# EAGLE schematic SenseoControl (EAGLE 6.1)
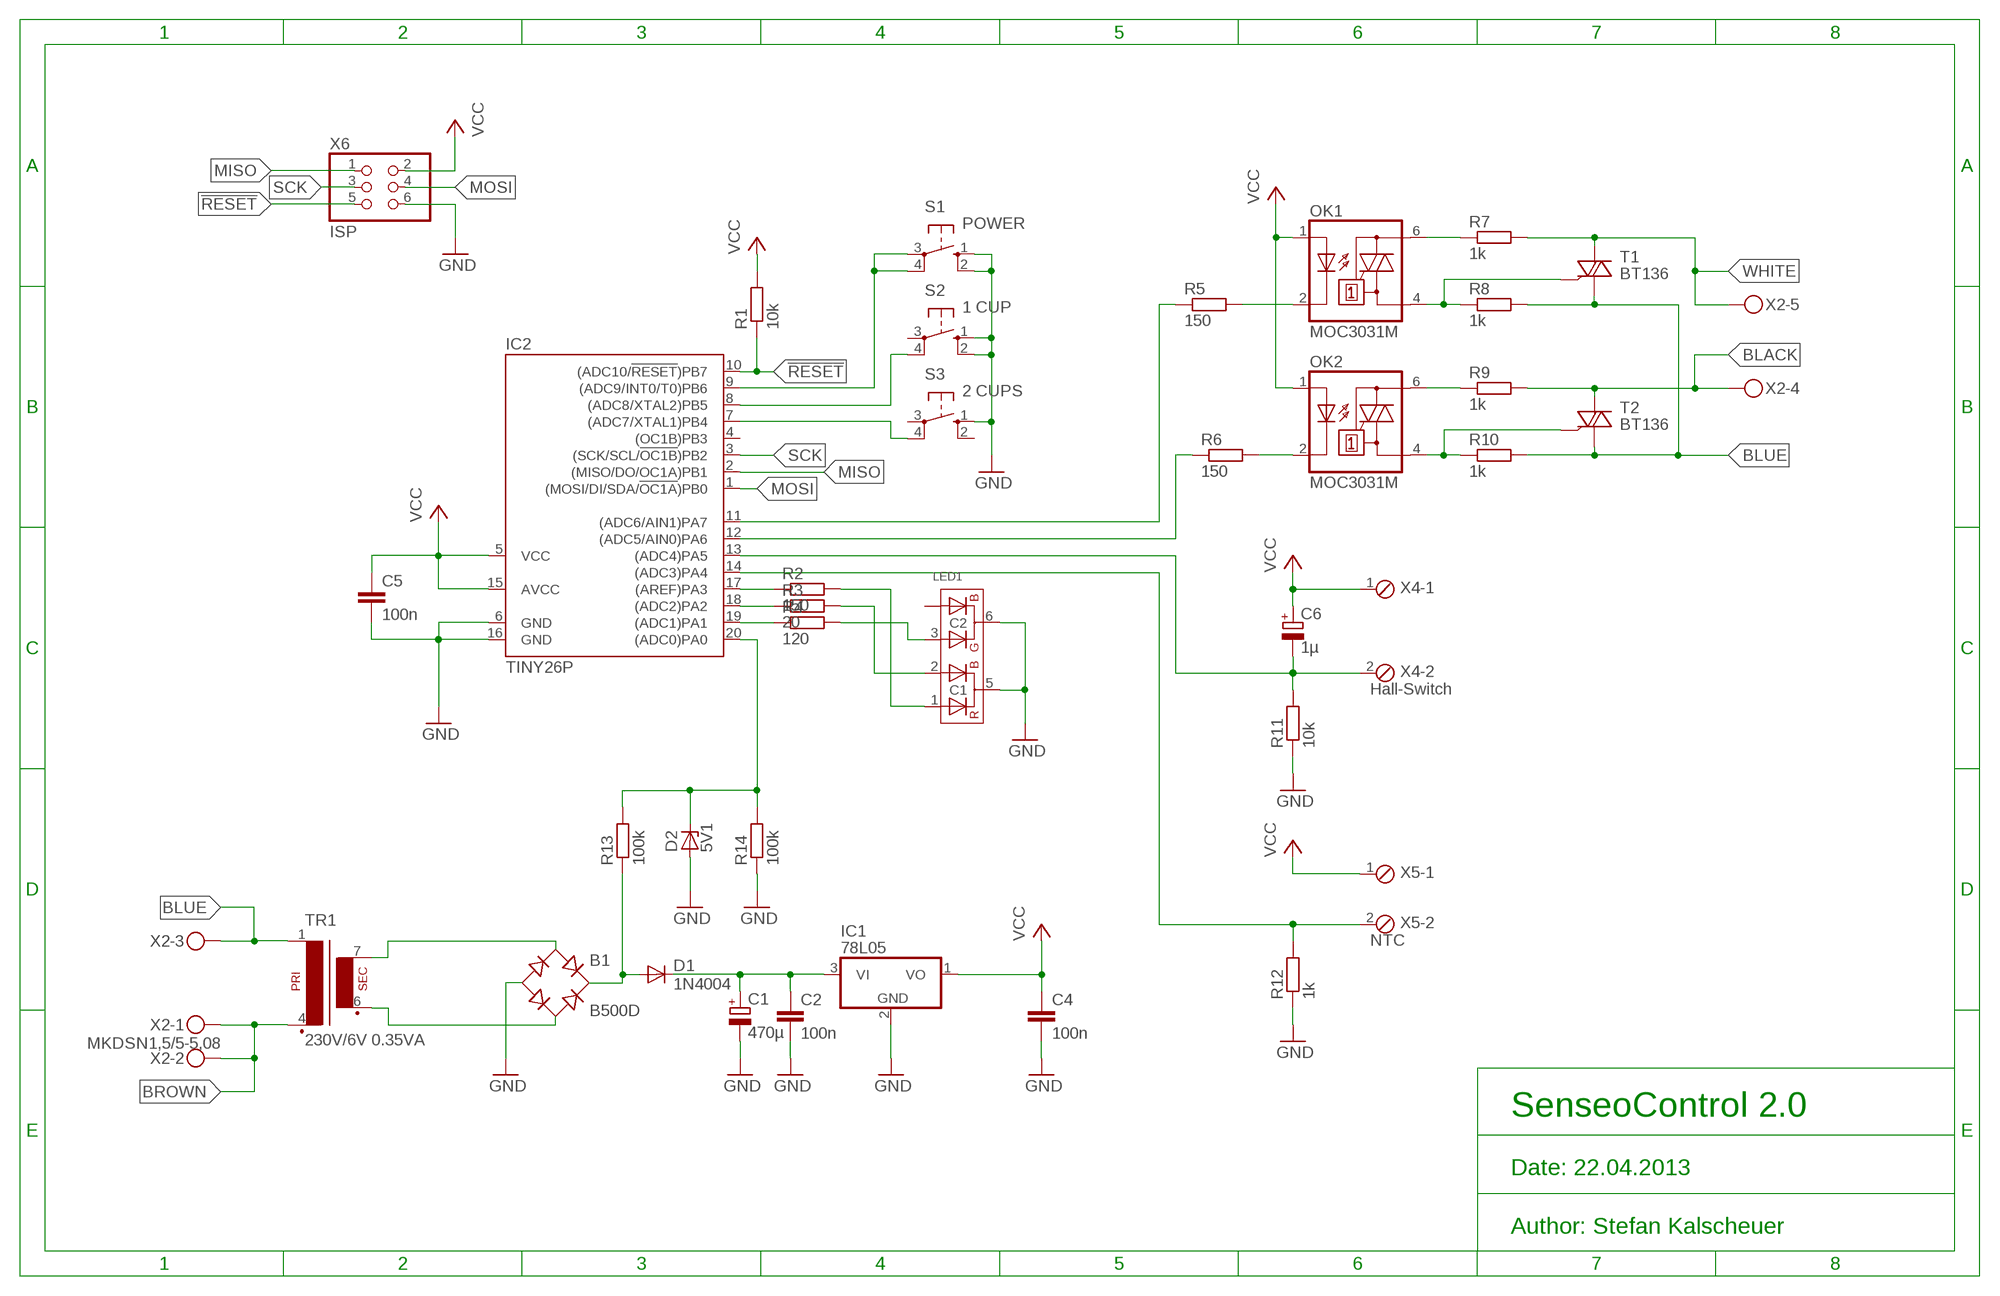
[diagram p0: schematic, sheet 1]

## Parts
B1  B500D  B-DIL  [B-DIL]
C1  470µ  CPOL-EUE2.5-6  [E2,5-6]
C2  100n  C-EU025-024X044  [C025-024X044]
C4  100n  C-EU025-024X044  [C025-024X044]
C5  100n  C-EU025-024X044  [C025-024X044]
C6  1µ  CPOL-EUTT2D5  [TT2D5]
D1  1N4004  DIODE-D-2.5  [D-2.5]
D2  5V1  ZENER-DIODEZD-7.5  [ZDIO-7.5]
IC1  78L05  78L2  [TO92-A]
IC2  TINY26P  [DIL20]
LED1  LF5  [LF5]
OK1  MOC3031M  [DIL06]
OK2  MOC3031M  [DIL06]
R1  10k  R-EU_0207/12  [0207/12]
R2  150  R-EU_0204/7  [0204/7]
R3  20  R-EU_0204/7  [0204/7]
R4  120  R-EU_0204/7  [0204/7]
R5  150  R-EU_0204/7  [0204/7]
R6  150  R-EU_0204/7  [0204/7]
R7  1k  R-EU_0204/7  [0204/7]
R8  1k  R-EU_0204/7  [0204/7]
R9  1k  R-EU_0204/7  [0204/7]
R10  1k  R-EU_0204/7  [0204/7]
R11  10k  R-EU_0204/7  [0204/7]
R12  1k  R-EU_0204/7  [0204/7]
R13  100k  R-EU_0204/7  [0204/7]
R14  100k  R-EU_0204/7  [0204/7]
S1  POWER  10-XXA  [B3F-10XX-A]
S2  1 CUP  10-XXA  [B3F-10XX-A]
S3  2 CUPS  10-XXA  [B3F-10XX-A]
T1  BT136  [TO220AB]
T2  BT136  [TO220AB]
TR1  230V/6V 0.35VA  EE20-1  [EE20-1]
X2  MKDSN1,5/5-5,08  [MKDSN1,5/5-5,08]
X4  Hall-Switch  MPT2  [2POL254]
X5  NTC  MPT2  [2POL254]
X6  ISP  PINHD-2X3  [2X03]

## Nets
!RESET: IC2.10((ADC10/!RESET!)PB7) R1.1 X6.5
BLACK: R9.2 T2.2(A2) X2.4
BLUE: R8.2 R10.2 T1.1(A1) T2.1(A1) TR1.1 X2.3
BROWN: TR1.4(P2) X2.1 X2.2
GND: B1.- C1.- C2.2 C4.2 C5.2 D2.A IC1.2(GND) IC2.6(GND) IC2.16(GND) LED1.5(C1) LED1.6(C2) R11.1 R12.1 R14.1 S1.1(S) S1.2(S1) S2.1(S) S2.2(S1) S3.1(S) X6.6
MISO: IC2.2((MISO/DO/OC1A)PB1) X6.1
MOSI: IC2.1((MOSI/DI/SDA/!OC1A!)PB0) X6.4
N$1: LED1.2(A-BLUE) R3.2
N$2: B1.AC1 TR1.7(S4)
N$3: OK1.4(A1) R8.1 T1.3(G)
N$4: B1.AC2 TR1.6(S3)
N$5: IC2.18((ADC2)PA2) R3.1
N$6: D2.C IC2.20((ADC0)PA0) R13.2 R14.2
N$7: C1.+ C2.1 D1.C IC1.3(VI)
N$8: IC2.7((ADC7/XTAL1)PB4) S3.4(P1)
N$9: IC2.8((ADC8/XTAL2)PB5) S2.4(P1)
N$10: IC2.9((ADC9/INT0/T0)PB6) S1.3(P) S1.4(P1)
N$11: IC2.17((AREF)PA3) R2.1
N$12: LED1.3(A_GREEN) R4.2
N$13: LED1.1(A-RED) R2.2
N$14: B1.+ D1.A R13.1
N$15: IC2.19((ADC1)PA1) R4.1
N$17: IC2.11((ADC6/AIN1)PA7) R5.1
N$18: IC2.12((ADC5/AIN0)PA6) R6.1
N$19: OK1.6(A2) R7.1
N$21: OK2.6(A2) R9.1
N$22: OK2.4(A1) R10.1 T2.3(G)
N$23: OK2.2(C) R6.2
N$25: OK1.2(C) R5.2
N$27: C6.- IC2.13((ADC4)PA5) R11.2 X4.2
N$29: IC2.14((ADC3)PA4) R12.2 X5.2
SCK: IC2.3((SCK/SCL/!OC1B!)PB2) X6.3
VCC: C4.1 C5.1 C6.+ IC1.1(VO) IC2.5(VCC) IC2.15(AVCC) OK1.1(A) OK2.1(A) R1.2 X4.1 X5.1 X6.2
WHITE: R7.2 T1.2(A2) X2.5
Unconnected: IC2.4((OC1B)PB3) LED1.4(A-BLUE2) S2.3(P) S3.2(S1) S3.3(P)

## Notes on the sheet
- SenseoControl 2.0
- Date: 22.04.2013
- Author: Stefan Kalscheuer

## Library data of the parts
B1 = rectifier:B-DIL: RECTIFIER
C1 C6 = resistor:CPOL-EU: POLARIZED CAPACITOR, European symbol
C2 C4 C5 = resistor:C-EU: CAPACITOR, European symbol
D1 = diode:DIODE-: DIODE
D2 = diode:ZENER-DIODE: Z-Diode
IC1 = linear:78*: Positive VOLTAGE REGULATOR Source: http://cache.national.com/ds/LM/LM78L05.pdf http://www.fairchildsemi.com/ds/LM/LM7805.pdf
IC2 = atmel:TINY26*: 8-bit AVR Microcontroller with 2K Bytes Flash Source: http://www.atmel.com .. doc1477.pdf; MPN: ATTINY261-20PU; OC_FARNELL: 1455146; OC_NEWARK: 58M3782
LED1 = led-rgb:LF5
OK1 OK2 = optocoupler:MOC30*: 6-Pin DIP Zero-Cross Optoisolators Triac Driver Output (250/400 Volt Peak) Source: http://www.fairchildsemi.com/ds/MO/MOC3043-M.pdf; MF: FAIRCHILD SEMICONDUCTOR; MPN: MOC3031M; OC_FARNELL: 9875964; OC_NEWARK: 78K6089
R1-R14 = resistor:R-EU_: RESISTOR, European symbol
S1-S3 = switch-omron:10-XX: OMRON SWITCH
T1 T2 = triac:BT136: Triac BT136 series E sensitive gate Source: http://www.nxp.com/acrobat_download/datasheets/BT136_SERIES_E_2.pdf
TR1 = trafo:EE20-1: TRANSFORMER 1 primary winding, 1 secondary winding ERA
X2 = con-phoenix-508:MKDSN1,5/5-5,08: MKDSN 1,5/ 5-5,08 Printklemme Nennstrom: 13,5 A Nennspannung: 250 V Rastermaß: 5,08 mm Polzahl: 5 Anschlussart: Schraubanschluss Montage: Löten Anschlussrichtung Leiter/Platine: 0 ° Artikelnummer: 1729157 Source: http://eshop.phoenixcontact.com .. 1729157.pdf; MPN: SMKDSN1,5/5-5,08; OC_FARNELL: 1792906; OC_NEWARK: 70R0301
X4 X5 = con-phoenix-254:MPT2: PHOENIX CONNECTOR; OC_FARNELL: unknown; OC_NEWARK: unknown
X6 = pinhead:PINHD-2X3: PIN HEADER